# Altium schematic sheet car.SchDoc
size A3
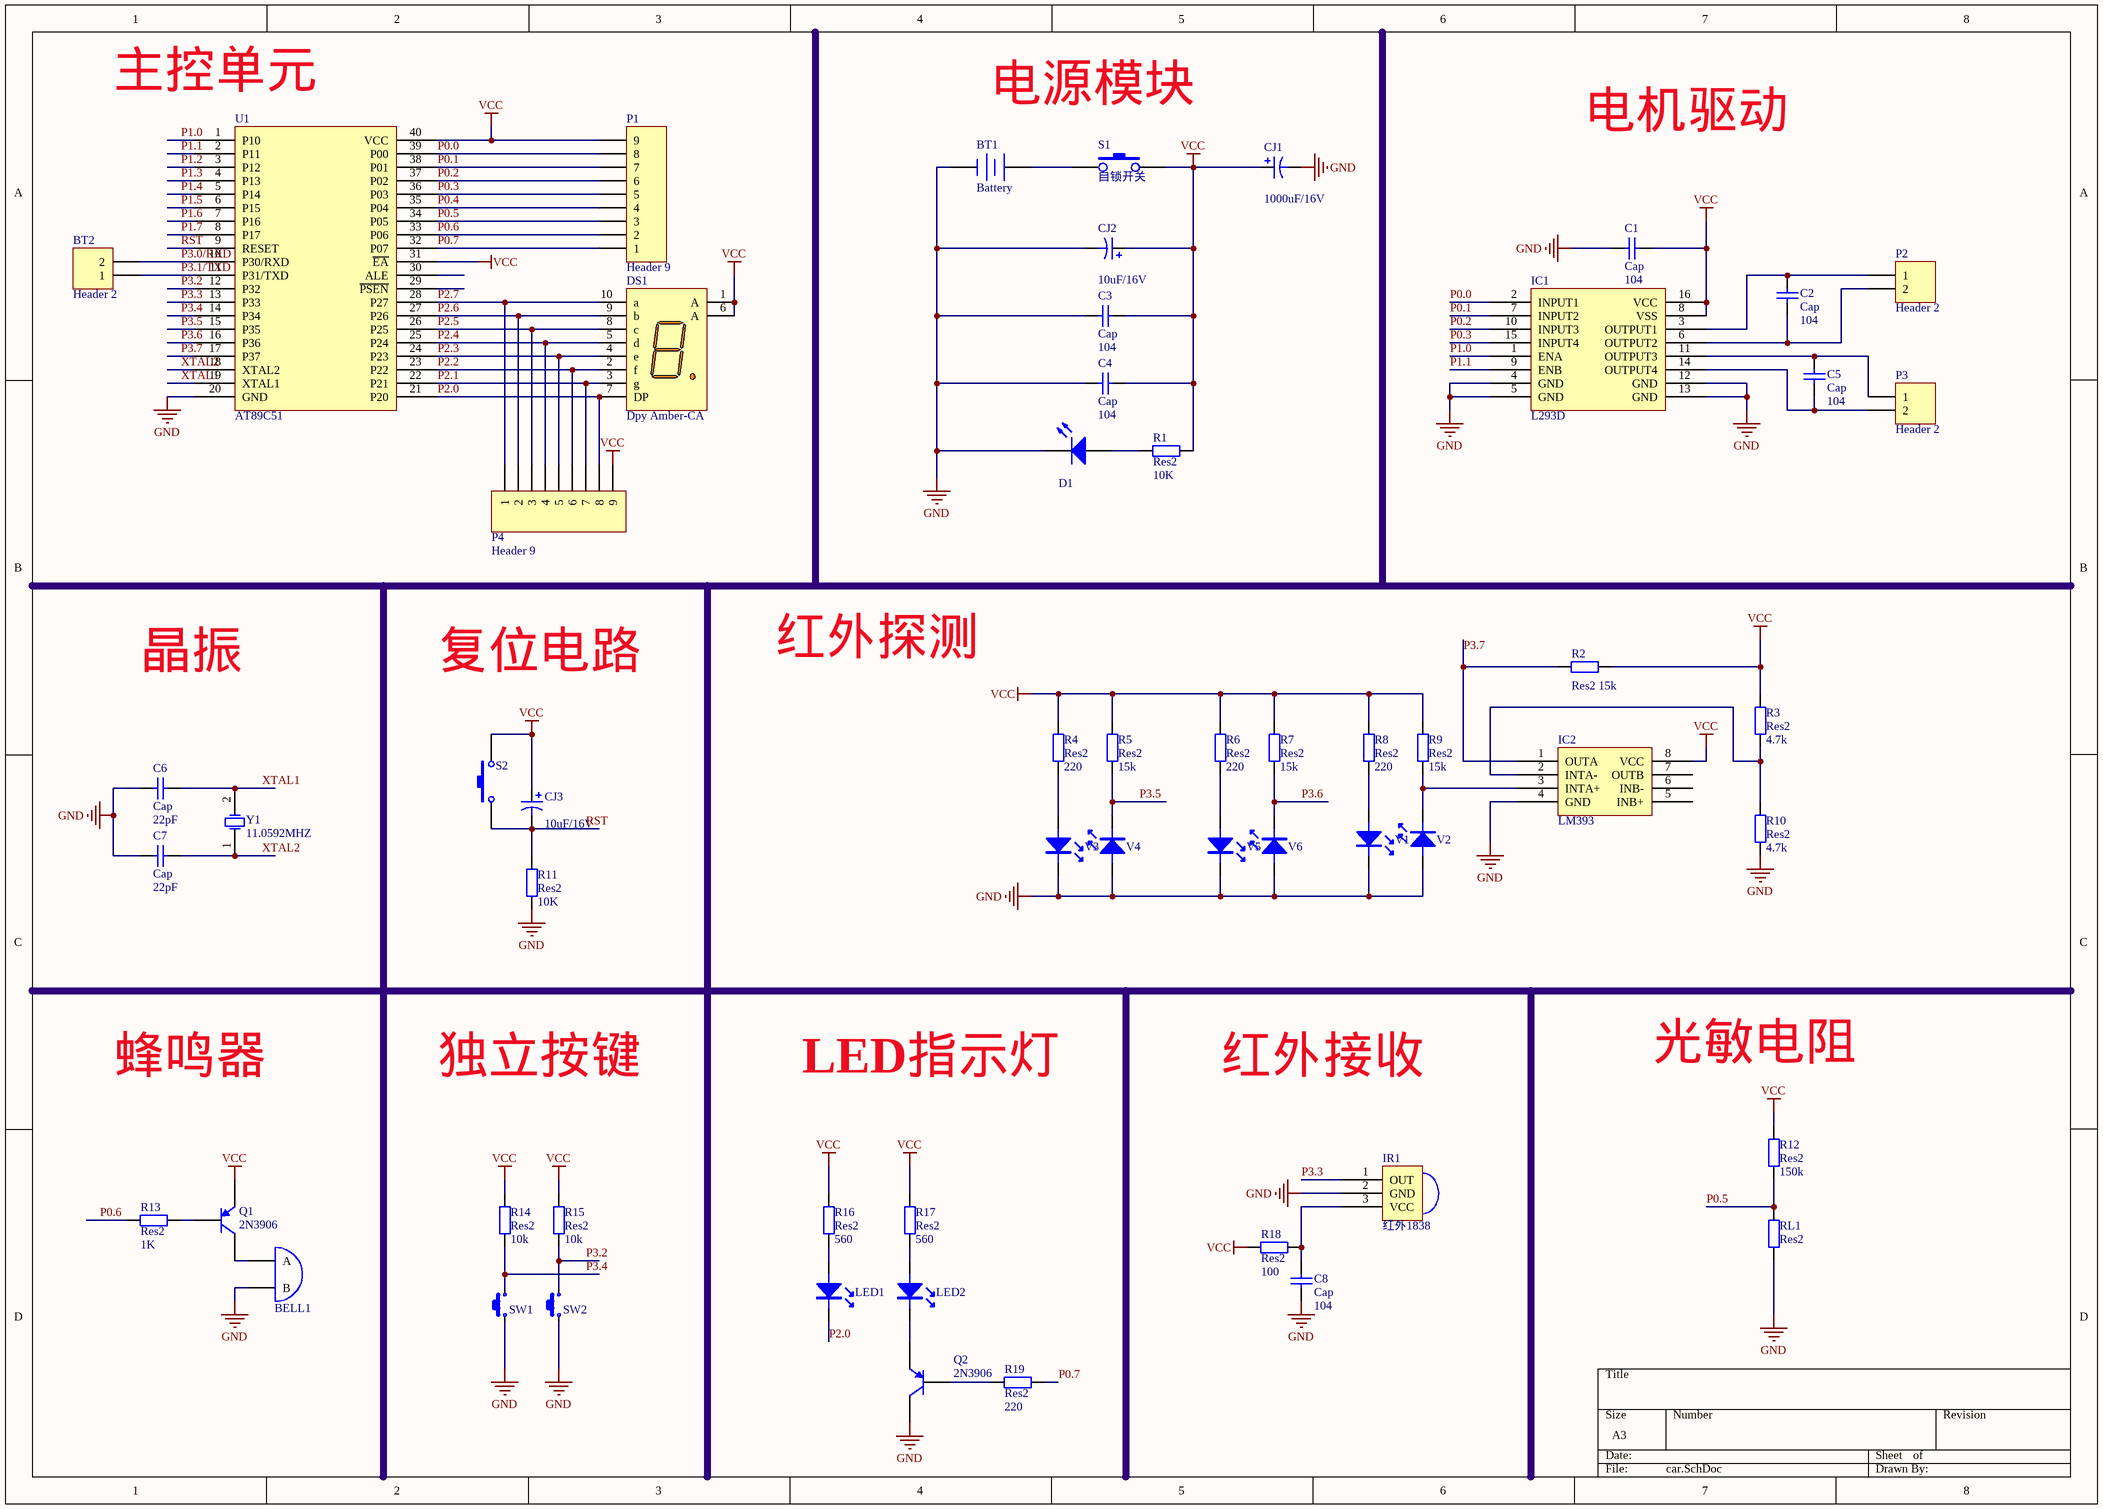
[diagram p0: car.SchDoc]

## Parts
BELL1  BELL  [BELL]  (value not drawn)
BT1  Battery  [BAT-2]
BT2  Header 2  [HDR1X2]
C1  Cap  value 104  [0805C]
C2  Cap  value 104  [0805C]
C3  Cap  value 104  [0805C]
C4  Cap  value 104  [0805C]
C5  Cap  value 104  [0805C]
C6  Cap  value 22pF  [0805C]
C7  Cap  value 22pF  [0805C]
C8  Cap  value 104  [0805C]
CJ1  value 1000uF/16V  [RB10U]
CJ2  value 10uF/16V  [RB10U]
CJ3  value 10uF/16V  [RB10U]
D1  LED0  [0805-LED]  (value not drawn)
DS1  Dpy Amber-CA  [A]
IC1  L293D  [L293D]
IC2  LM393  [LM393]
IR1  红外1838  [红外1838]
LED1  LED  [0805-LED]  (value not drawn)
LED2  LED  [0805-LED]  (value not drawn)
P1  Header 9  [HDR1X9]
P2  Header 2  [HDR1X2]
P3  Header 2  [HDR1X2]
P4  Header 9  [HDR1X9]
Q1  2N3906  [TO-92A]
Q2  2N3906  [TO-92A]
R1  Res2  value 10K  [0805]
R2  Res2  value 15k  [0805]
R3  Res2  value 4.7k  [0805]
R4  Res2  value 220  [0805]
R5  Res2  value 15k  [0805]
R6  Res2  value 220  [0805]
R7  Res2  value 15k  [0805]
R8  Res2  value 220  [0805]
R9  Res2  value 15k  [0805]
R10  Res2  value 4.7k  [0805]
R11  Res2  value 10K  [0805]
R12  Res2  value 150k  [0805]
R13  Res2  value 1K  [0805]
R14  Res2  value 10k  [0805]
R15  Res2  value 10k  [0805]
R16  Res2  value 560  [0805]
R17  Res2  value 560  [0805]
R18  Res2  value 100  [0805]
R19  Res2  value 220  [0805]
RL1  Res2  [AXIAL-0.4]
S1  自锁开关  [自锁开关]
S2  (no value)  [SWD]
SW1  SW  [SWD]  (value not drawn)
SW2  SW  [SWD]  (value not drawn)
U1  AT89C51  [89c52]
V1  红外管  [红外管]  (value not drawn)
V2  红外管  [红外管]  (value not drawn)
V3  红外管  [红外管]  (value not drawn)
V4  红外管  [红外管]  (value not drawn)
V5  红外管  [红外管]  (value not drawn)
V6  红外管  [红外管]  (value not drawn)
Y1  11.0592MHZ  [XTAL]

## Nets
GND: BELL1.2(B) BT1.2(-) C1.1 C3.1 C4.1 C6.1 C7.1 C8.1 CJ1.2 CJ2.2 D1.2(K) IC1.4(GND) IC1.5(GND) IC1.12(GND) IC1.13(GND) IC2.4(GND) IR1.2(GND) Q2.3(C) R10.1 R11.1 RL1.1 SW1.1 SW2.1 U1.20(GND) V1.2 V2.1 V3.2 V4.1 V5.2 V6.1
VCC: C1.2 C3.2 C4.2 CJ1.1 CJ2.1 CJ3.1 DS1.1(A) DS1.6(A) IC1.8(VSS) IC1.16(VCC) IC2.8(VCC) P1.9 P4.9 Q1.1(E) R1.1 R2.2 R3.2 R4.1 R5.1 R6.1 R7.1 R8.1 R9.1 R12.1 R14.1 R15.1 R16.1 R17.1 R18.2 S1.5 S2.2 U1.31(~{EA}) U1.40(VCC)
P0.0: IC1.2(INPUT1) P1.8 U1.39(P00)
P0.1: IC1.7(INPUT2) P1.7 U1.38(P01)
P0.2: IC1.10(INPUT3) P1.6 U1.37(P02)
P0.3: IC1.15(INPUT4) P1.5 U1.36(P03)
P0.4: P1.4 U1.35(P04)
P0.5: P1.3 R12.2 RL1.2 U1.34(P05)
P0.6: P1.2 R13.2 U1.33(P06)
P0.7: P1.1 R19.2 U1.32(P07)
P1.0: IC1.1(ENA) U1.1(P10)
P1.1: IC1.9(ENB) U1.2(P11)
P1.2: U1.3(P12)
P1.3: U1.4(P13)
P1.4: U1.5(P14)
P1.5: U1.6(P15)
P1.6: U1.7(P16)
P1.7: U1.8(P17)
P2.0: DS1.7(DP) LED1.2 P4.8 U1.21(P20)
P2.1: DS1.3(g) P4.7 U1.22(P21)
P2.2: DS1.2(f) P4.6 U1.23(P22)
P2.3: DS1.4(e) P4.5 U1.24(P23)
P2.4: DS1.5(d) P4.4 U1.25(P24)
P2.5: DS1.8(c) P4.3 U1.26(P25)
P2.6: DS1.9(b) P4.2 U1.27(P26)
P2.7: DS1.10(a) P4.1 U1.28(P27)
P3.0/RXD: BT2.2 U1.10(P30/RXD)
P3.1/TXD: BT2.1 U1.11(P31/TXD)
P3.2: R15.2 SW2.2 U1.12(P32)
P3.3: IR1.1(OUT) U1.13(P33)
P3.4: R14.2 SW1.2 U1.14(P34)
P3.5: R5.2 U1.15(P35) V4.2
P3.6: R7.2 U1.16(P36) V6.2
P3.7: IC2.1(OUTA) R2.1 U1.17(P37)
RST: CJ3.2 R11.2 S2.1 U1.9(RESET)
XTAL1: C6.2 U1.19(XTAL1) Y1.2(OSC2)
XTAL2: C7.2 U1.18(XTAL2) Y1.1(OSC1)
NetBELL1_1: BELL1.1(A) Q1.3(C)
NetBT1_1: BT1.1(+) S1.3
NetC2_1: C2.1 IC1.6(OUTPUT2) P2.2
NetC2_2: C2.2 IC1.3(OUTPUT1) P2.1
NetC5_1: C5.1 IC1.14(OUTPUT4) P3.2
NetC5_2: C5.2 IC1.11(OUTPUT3) P3.1
NetC8_2: C8.2 IR1.3(VCC) R18.1
NetD1_1: D1.1(A) R1.2
NetIC2_2: IC2.2(INTA-) R3.1 R10.2
NetIC2_3: IC2.3(INTA+) R9.2 V2.2
NetLED1_1: LED1.1 R16.2
NetLED2_1: LED2.1 R17.2
NetLED2_2: LED2.2 Q2.1(E)
NetQ1_2: Q1.2(B) R13.1
NetQ2_2: Q2.2(B) R19.1
NetR4_2: R4.2 V3.1
NetR6_2: R6.2 V5.1
NetR8_2: R8.2 V1.1

Not connected (* = marked no-connect by the designer): IC2 5(INB+) 6(INB-) 7(OUTB); U1 29(~{PSEN}) 30(ALE)

## Notes on the sheet
- (near U1) 主控单元
- 电源模块
- 电机驱动
- 晶振
- 复位电路
- 红外探测
- 蜂鸣器
- 独立按键
- LED指示灯
- 红外接收
- 光敏电阻

## Library data of the parts
BT1 = Battery: Multicell Battery; Published: 24-Mar-1999; LatestRevisionDate: 17-Jul-2002; LatestRevisionNote: Re-released for DXP Platform.; PackageReference: BAT-2; Publisher: Altium Limited; PackageDescription: Battery; 2 Leads
BT2 P2 P3 = Header 2: Header, 2-Pin; LatestRevisionDate: 17-Jul-2002; LatestRevisionNote: Re-released for DXP Platform.; Publisher: Altium Limited
C1-C8 = Cap: Capacitor; Published: 8-Jun-2000; LatestRevisionDate: 17-Jul-2002; LatestRevisionNote: Re-released for DXP Platform.; PackageReference: RAD-0.3; Publisher: Altium Limited
CJ1-CJ3 = Cap Pol1: Polarized Capacitor (Radial); Published: 8-Jun-2000; LatestRevisionDate: 17-Jul-2002; LatestRevisionNote: Re-released for DXP Platform.; PackageReference: RB7.6-15; Publisher: Altium Limited
D1 = LED0: Typical INFRARED GaAs LED; Published: 8-Jun-2000; LatestRevisionDate: 08-Jul-2005; LatestRevisionNote: Mech Layer 1 removed.; PackageReference: LED-0; Publisher: Altium Limited
DS1 = Dpy Amber-CA: 7.62 mm Black Surface Orange 7-Segment Display: CA, RH DP; MinimumIntensity: 354 ucd; Note: IF = 5 mA; Note: Pins 1 and 6 are redundant Anodes.; Published: 8-Jun-2000; LatestRevisionDate: 17-Dec-2003; LatestRevisionNote: Schematic revised, PCB Footprint replaced.; DatasheetVersion: 19-Feb-2002; PackageVersion: 11-Feb-2002; PackageReference: A; Publisher: Altium Limited; PackageDescription: LED, 7-Segment Display, 7.62 mm, RHD; 10 Leads; Row Space 5.08 mm; Pitch 2.54 mm; Colour: Orange; ComponentLink1Description: Manufacturer Link; ComponentLink1URL: http://www.agilent.com/
P1 P4 = Header 9: Header, 9-Pin; LatestRevisionDate: 17-Jul-2002; LatestRevisionNote: Re-released for DXP Platform.; Publisher: Altium Limited
Q1 Q2 = 2N3906: PNP General Purpose Amplifier; Published: 8-Jun-2000; LatestRevisionDate: 15-Jan-2003; LatestRevisionNote: PCB Footprint 'BCY-W3/D4.7' replaced; DatasheetVersion: 1997; PackageVersion: Sep-1998; PackageReference: TO-92A; Publisher: Altium Limited; PackageDescription: TO, Flat Index; 3 In-Line, Axial Leads; Body Dia. 4.5mm; Leads 0.51 x 0.48 mm (max); ComponentLink1Description: Manufacturer Link; ComponentLink1URL: http://www.fairchildsemi.com/; ComponentLink2Description: Datasheet; ComponentLink2URL: http://www.fairchildsemi.com/ds/2N%2F2N3906.pdf
R1-R19 RL1 = Res2: Resistor; Published: 8-Jun-2000; LatestRevisionDate: 17-Jul-2002; LatestRevisionNote: Re-released for DXP Platform.; PackageReference: AXIAL-0.4; Publisher: Altium Limited
  RL1: PackageDescription: Axial Device, Thru-Hole; 2 Leads; 0.4 in Pin Spacing
S2 = SW-PB: Switch; Published: 24-Mar-1999; LatestRevisionDate: 17-Jul-2002; LatestRevisionNote: Re-released for DXP Platform.; PackageReference: SPST-2; Publisher: Altium Limited
V1-V6 = LED
Y1 = XTAL: Crystal Oscillator; Published: 8-Jun-2000; LatestRevisionDate: 17-Jul-2002; LatestRevisionNote: Re-released for DXP Platform.; PackageReference: R38; Publisher: Altium Limited